# EAGLE schematic thesolderstation_v0.1 (EAGLE 6.6.0)
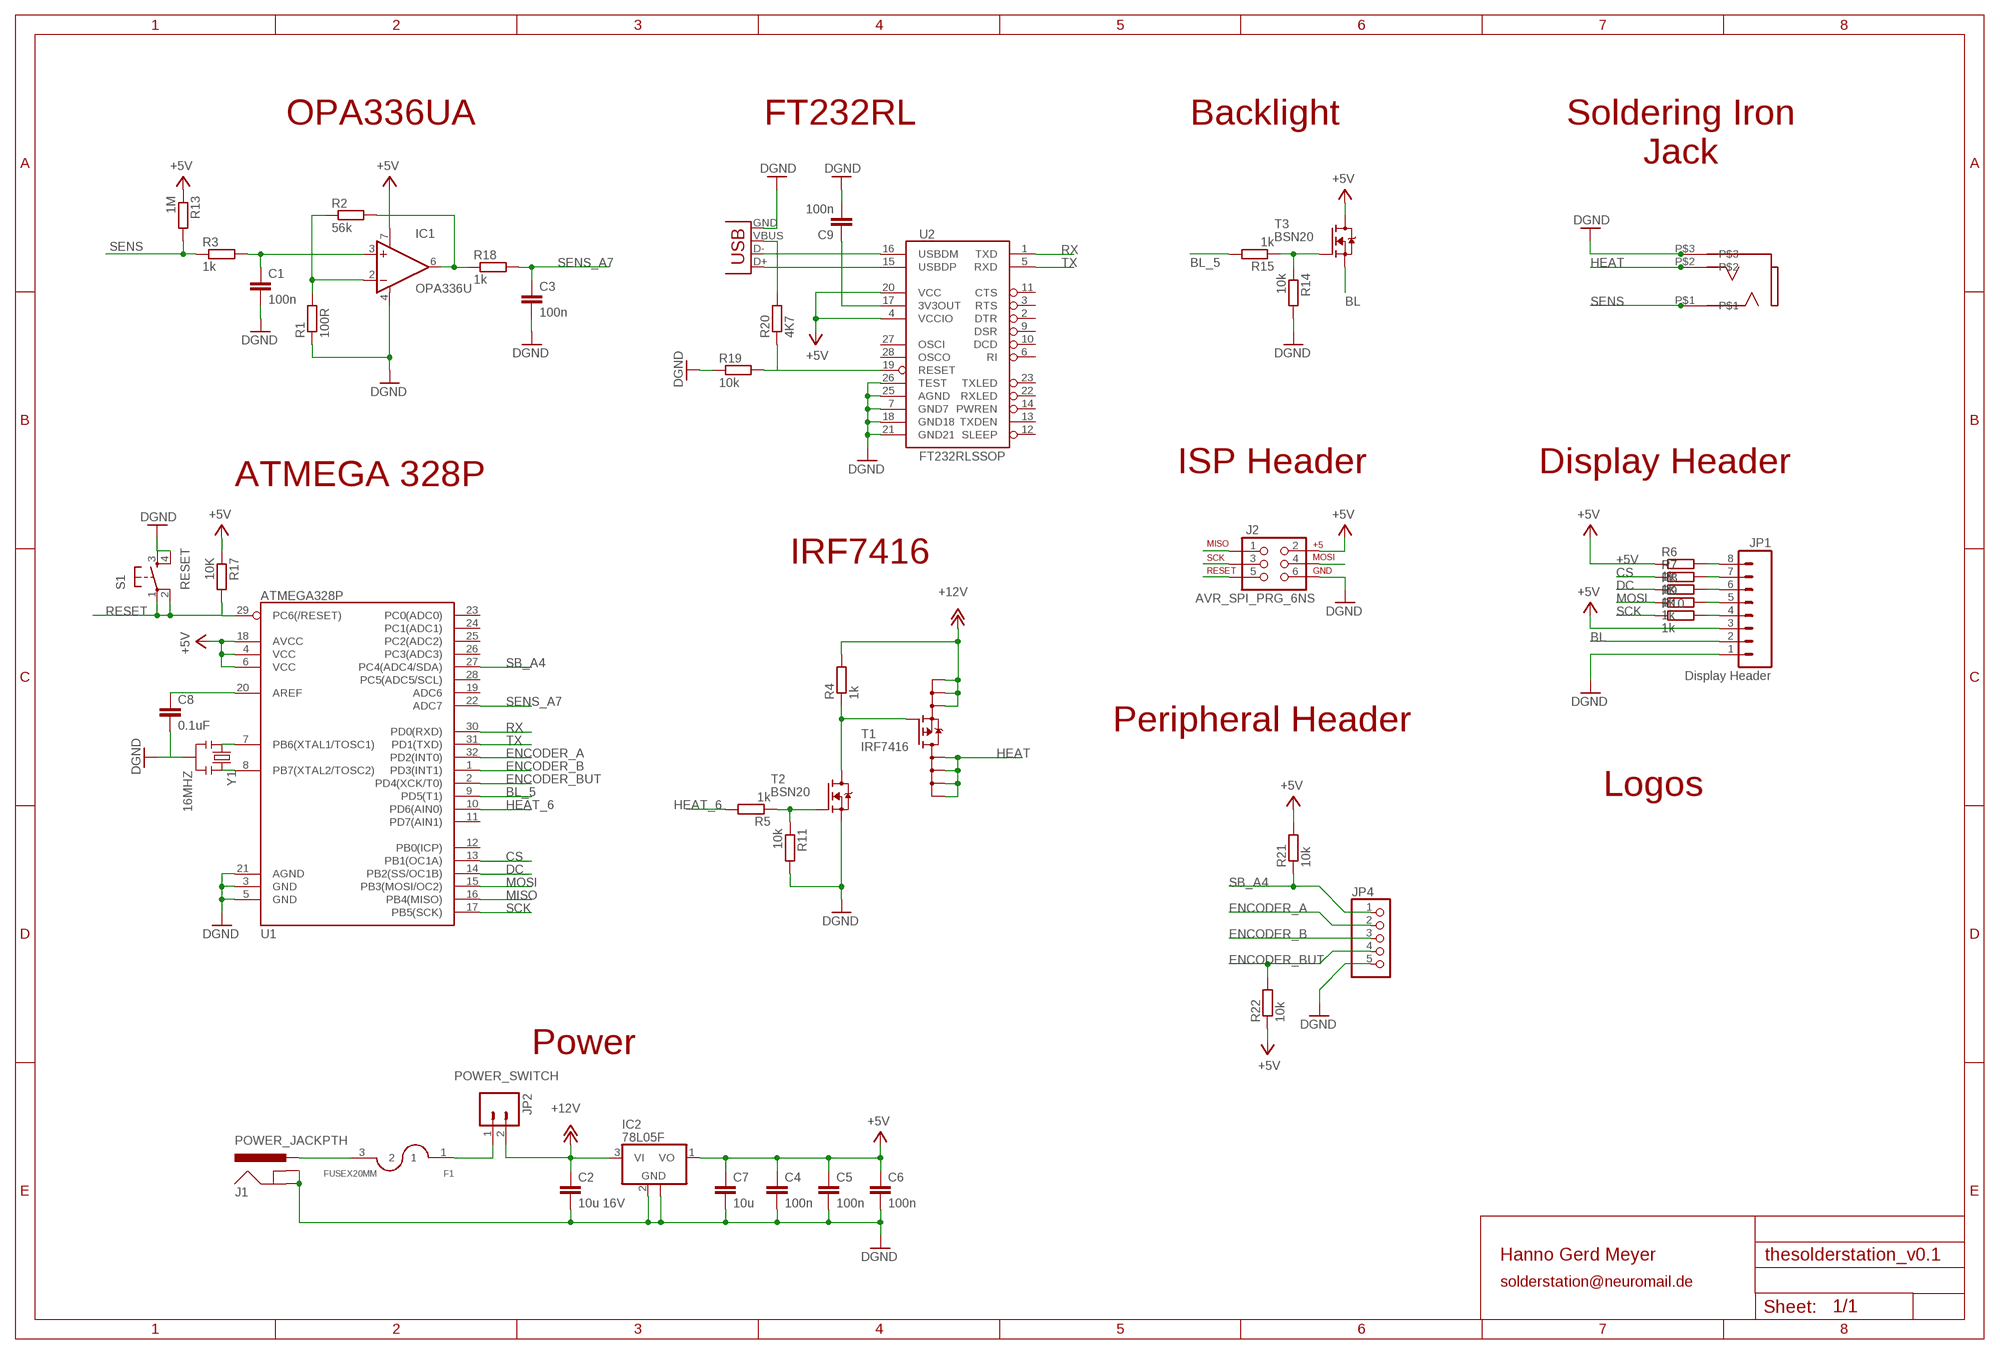
[diagram p0: schematic, sheet 1]

## Parts
C1  100n  C-EUC0603  [C0603]
C2  10u 16V  C-EUC1206  [C1206]
C3  100n  C-EUC0603  [C0603]
C4  100n  C-EUC0603  [C0603]
C5  100n  C-EUC0603  [C0603]
C6  100n  C-EUC0603  [C0603]
C7  10u  C-EUC1206  [C1206]
C8  0.1uF  C-EUC0603  [C0603]
C9  100n  C-EUC0603  [C0603]
F1  FUSEX20MM  [FUSE_5MM]
IC1  OPA336U  [SO08]
IC2  78L05F  [SOT89]
J1  POWER_JACKPTH  [POWER_JACK_PTH]
J2  AVR_SPI_PRG_6NS  [2X3-NS]
JP1  Display Header  M08LOCK  [1X08_LOCK]
JP2  POWER_SWITCH  M02LOCK_LONGPADS  [1X02_LOCK_LONGPADS]
JP4  PINHD-1X5  [1X05]
JP5  USB-B  USBPTH  [USB-B-PTH]
R1  100R  R-EU_R0603  [R0603]
R2  56k  R-EU_R0603  [R0603]
R3  1k  R-EU_R0603  [R0603]
R4  1k  R-EU_R0603  [R0603]
R5  1k  R-EU_R0603  [R0603]
R6  1k  R-EU_R0603  [R0603]
R7  1k  R-EU_R0603  [R0603]
R8  1k  R-EU_R0603  [R0603]
R9  1k  R-EU_R0603  [R0603]
R10  1k  R-EU_R0603  [R0603]
R11  10k  R-EU_R0603  [R0603]
R13  1M  R-EU_R0603  [R0603]
R14  10k  R-EU_R0603  [R0603]
R15  1k  R-EU_R0603  [R0603]
R17  10K  R-EU_R0603  [R0603]
R18  1k  R-EU_R0603  [R0603]
R19  10k  R-EU_R0603  [R0603]
R20  4K7  R-EU_R0603  [R0603]
R21  10k  R-EU_R0603  [R0603]
R22  10k  R-EU_R0603  [R0603]
S1  RESET  TAC_SWITCHPTH  [TACTILE-PTH]
T1  IRF7416  [SO8]
T2  BSN20  [SOT23]
T3  BSN20  [SOT23]
U1  ATMEGA328P  ATMEGA328_SMT  [TQFP32-08]
U2  FT232RLSSOP  [SSOP28DB]
U$1  35RASMT2BHNTRX  [35RASMT2BHNTRX]
Y1  16MHZ  RESONATOR16MHZ  [RESONATOR-SMD]

## Nets
+5V: C4.1 C5.1 C6.1 C7.1 IC1.7(V+) IC2.1(VO) J2.2 JP1.3 R6.1 R13.1 R17.1 R21.2 R22.1 T3.3(D) U1.4(VCC) U1.6(VCC) U1.18(AVCC) U2.4(VCCIO) U2.20(VCC)
+12V: C2.1 IC2.3(VI) JP2.2 R4.2 T1.1(S0) T1.2(S1) T1.3(S2)
BL: JP1.2 T3.2(S)
BL_5: R15.2 U1.9(PD5(T1))
CS: R7.1 U1.13(PB1(OC1A))
DC: R8.1 U1.14(PB2(SS/OC1B))
DGND: C1.2 C2.2 C3.2 C4.2 C5.2 C6.2 C7.2 C8.2 C9.2 IC1.4(V-) IC2.2(GND) IC2.2@1(GND) J1.GND J1.GNDBREAK J2.6 JP1.1 JP4.5 JP5.GND R1.1 R11.2 R14.2 R19.1 S1.3 S1.4 T2.2(S) U1.3(GND) U1.5(GND) U1.21(AGND) U2.7(GND7) U2.18(GND18) U2.21(GND21) U2.25(AGND) U2.26(TEST) U$1.P$3 Y1.2
ENCODER_A: JP4.2 U1.32(PD2(INT0))
ENCODER_B: JP4.3 U1.1(PD3(INT1))
ENCODER_BUT: JP4.4 R22.2 U1.2(PD4(XCK/T0))
HEAT: T1.5(D0) T1.6(D1) T1.7(D2) T1.8(D3) U$1.P$2
HEAT_6: R5.2 U1.10(PD6(AIN0))
MISO: J2.1 U1.16(PB4(MISO))
MOSI: J2.4 R9.1 U1.15(PB3(MOSI/OC2))
N$1: IC1.2(-IN) R1.2 R2.1
N$2: IC1.6(OUT) R2.2 R18.1
N$3: R5.1 R11.1 T2.1(G)
N$4: C1.1 IC1.3(+IN) R3.2
N$5: R4.1 T1.4(G) T2.3(D)
N$6: JP1.4 R10.2
N$7: F1.3 J1.PWR
N$8: JP1.5 R9.2
N$9: JP1.6 R8.2
N$10: JP1.7 R7.2
N$11: JP1.8 R6.2
N$12: F1.1 JP2.1
N$14: R14.1 R15.1 T3.1(G)
N$17: C8.1 U1.20(AREF)
N$18: U1.7(PB6(XTAL1/TOSC1)) Y1.1
N$19: U1.8(PB7(XTAL2/TOSC2)) Y1.3
N$20: JP5.D- U2.16(USBDM)
N$21: JP5.D+ U2.15(USBDP)
N$22: JP5.VBUS R20.2
N$23: R19.2 R20.1 U2.19(RESET)
N$24: C9.1 U2.17(3V3OUT)
RESET: J2.5 R17.2 S1.1 S1.2 U1.29(PC6(/RESET))
RX: U1.30(PD0(RXD)) U2.1(TXD)
SB_A4: JP4.1 R21.1 U1.27(PC4(ADC4/SDA))
SCK: J2.3 R10.1 U1.17(PB5(SCK))
SENS: R3.1 R13.2 U$1.P$1
SENS_A7: C3.1 R18.2 U1.22(ADC7)
TX: U1.31(PD1(TXD)) U2.5(RXD)
Unconnected: U1.11(PD7(AIN1)) U1.12(PB0(ICP)) U1.19(ADC6) U1.23(PC0(ADC0)) U1.24(PC1(ADC1)) U1.25(PC2(ADC2)) U1.26(PC3(ADC3)) U1.28(PC5(ADC5/SCL)) U2.2(DTR) U2.3(RTS) U2.6(RI) U2.9(DSR) U2.10(DCD) U2.11(CTS) U2.12(SLEEP) U2.13(TXDEN) U2.14(PWREN) U2.22(RXLED) U2.23(TXLED) U2.27(OSCI) U2.28(OSCO)

## Notes on the sheet
- OPA336UA | FT232RL | Backlight
- Soldering Iron
  Jack
- ISP Header | Display Header
- ATMEGA 328P
- IRF7416
- Peripheral Header
- Logos
- Power
- Hanno Gerd Meyer
- solderstation@neuromail.de

## Library data of the parts
C1-C9 = rcl:C-EU: CAPACITOR, European symbol
F1 = SparkFun-Passives:FUSE
IC1 = burr-brown:OPA336: CMOS Operational Amplifiers Single-Supply, MicroPower, MicroAmplifier(TM) Series; MF: TEXAS INSTRUMENT CONNECTORS; MPN: OPA336UA; OC_FARNELL: 1459587; OC_NEWARK: 35C1888
IC2 = linear:78L*: POSITOIV-VOLTAGE REGULATORS Output up to 100 mA Source: Datasheet <http://focus.ti.com/lit/ds/symlink/ua78l05.pdf>
J1 = SparkFun:POWER_JACK: Power Jack This is the standard 5.5mm barrel jack for power. The PTH is the most common, proven, reliable, footprint. All others are experimental. The Slot footprint only works if the mill layer is transmitted to the PCB fab house so be warned. Spark Fun Electronics SKU : PRT-00119. Mating wall wart : TOL-00298 (and others)
J2 = SparkFun-Connectors:AVR_SPI_PRG_6: AVR ISP 6 Pin This is the reduced ISP connector for AVR programming. Common on Arduino. This footprint will take up less PCB space and can be used with a 10-pin to 6-pin adapter such as SKU: BOB-08508 **Special note about "TEST_POINT" package. The stop mask is on the top side, so if you want your programming test points to be on the bottom of your board, make sure to place this package on the bottom side of the board. This also ensure that the orientation to program from the bottom side will be correct.
JP1 = SparkFun:M08: Header 8 Standard 8-pin 0.1" header. Use with straight break away headers (SKU : PRT-00116), right angle break away headers (PRT-00553), swiss pins (PRT-00743), machine pins (PRT-00117), and female headers (PRT-00115).
JP2 = SparkFun:M02: Header 2 Standard 2-pin 0.1" header. Use with straight break away headers (SKU : PRT-00116), right angle break away headers (PRT-00553), swiss pins (PRT-00743), machine pins (PRT-00117), and female headers (PRT-00115). Molex polarized connector foot print use with SKU : PRT-08233 with associated crimp pins and housings.
JP4 = pinhead:PINHD-1X5: PIN HEADER
JP5 = SparkFun-Connectors:USB: USB Connectors USB-B-PTH is fully proven SKU : PRT-00139/CONN-08278 USB-miniB is fully proven SKU : PRT-00587 USB-A-PCB is untested. USB-A-H is throughly reviewed, but untested. Spark Fun Electronics SKU : PRT-00437 USB-B-SMT is throughly reviewed, but untested. Needs silkscreen touching up. USB-A-S has not been used/tested USB-MB-H has not been used/tested USB-MICROB has been used. CONN-09505; PROD_ID: CONN-08278
R1-R11 R13-R15 R17-R22 = rcl:R-EU_: RESISTOR, European symbol
S1 = SparkFun-Electromechanical:TAC_SWITCH: Momentary Switch Button commonly used for reset or general input. Spark Fun Electronics SKU : COM-00097 SMT- SWCH-08247
T1 = IRF74xx:IRF7416
T2 T3 = bsn20:BSN20
U1 = SparkFun-DigitalIC:ATMEGA328_SMT: 32-Pin Atmega328 part Commonly used on Arduino compatible boards Available in QFP and QFN packages TQFP is IC-09069 QFN is non-stock; PROD_ID: IC-09069
U2 = SparkFun-DigitalIC:FT232RL: USB UART FT232RL 4th Generation USB UART (USB <-> Serial) Controller. Spark Fun Electronics SKU : COM-00650 Production SKU IC-00870; PROD_ID: IC-00870
U$1 = alvarop-lib:35RASMT2BHNTRX
Y1 = SparkFun-FreqCtrl:RESONATOR: Resonator Small SMD resonator. Used, eg, on the Arduino Pro/ Pro Mini boards. 8MHz- XTAL-08895 16MHz- XTAL-08900; PROD_ID: XTAL-08900